# EAGLE schematic SS4 (EAGLE 6.2)
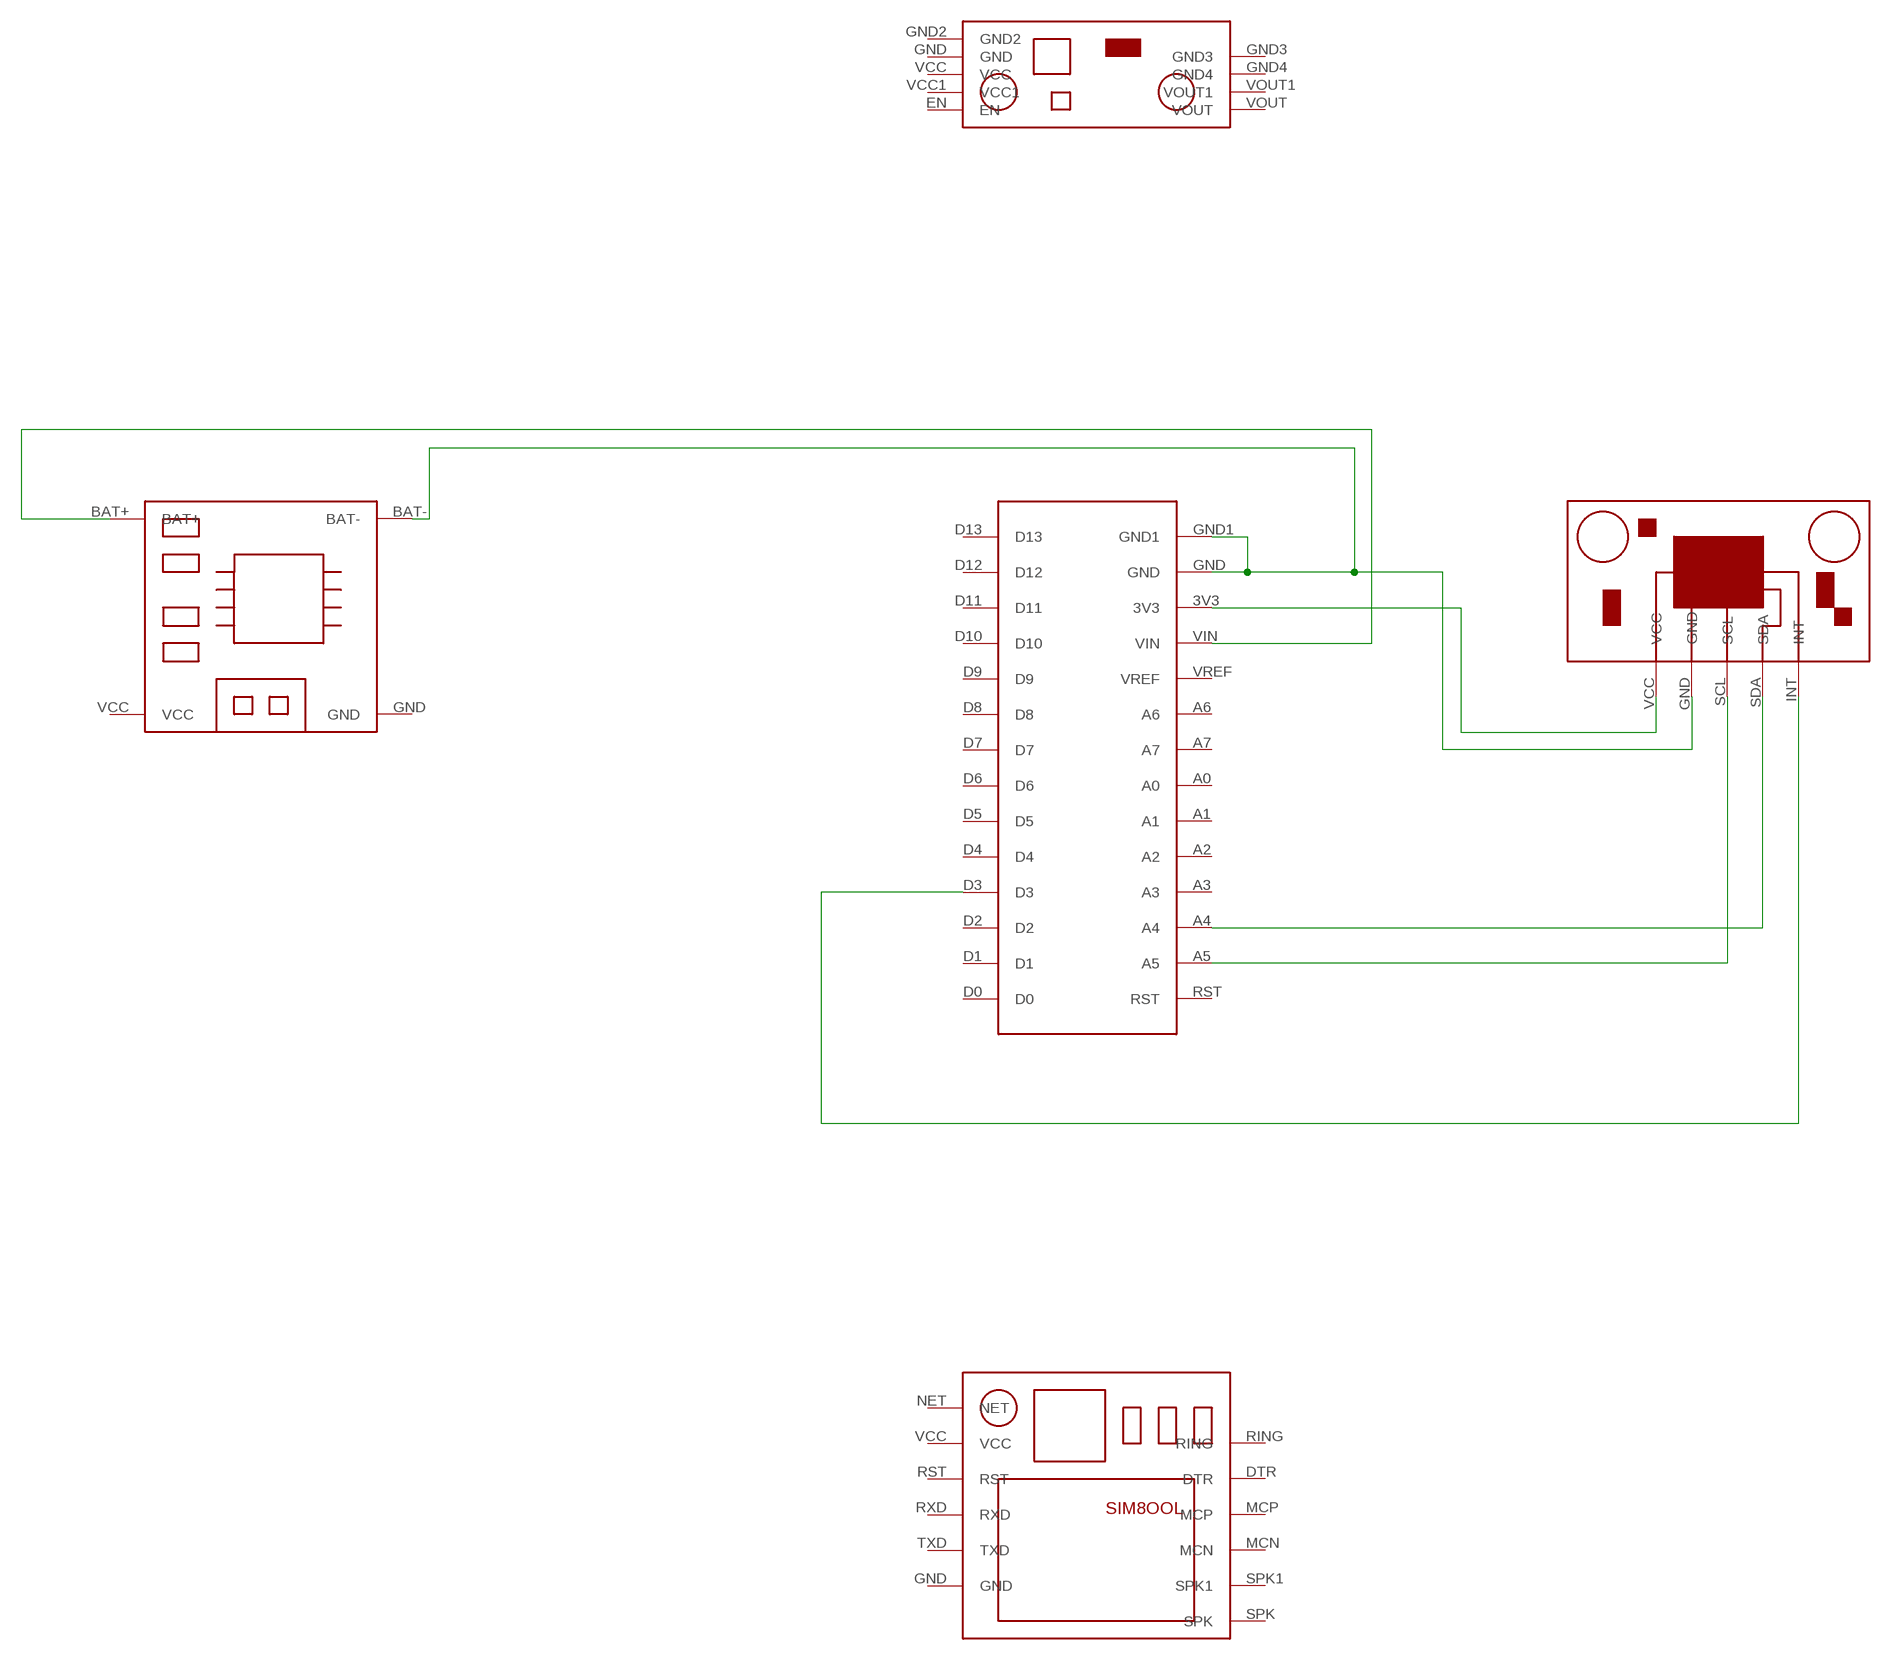
[diagram p0: schematic, sheet 1]

## Parts
U$1  ACELEROMETER  [ACELEROMETER]
U$2  POLOLU_STEP_UP_DOWN  [POLOLU_STEP_UP_DOWN]
U$3  CHARGER  [CHARGER]
U$4  SIM8OOL  [SIM8OOL]
U$5  ULTRA_MINI  [ULTRA_MINI]

## Nets
N$1: U$3.BAT+ U$5.VIN
N$3: U$1.GND U$3.BAT- U$5.GND U$5.GND1
N$4: U$1.VCC U$5.3V3
N$6: U$1.INT U$5.D3
N$7: U$1.SCL U$5.A5
N$8: U$1.SDA U$5.A4
Unconnected: U$2.EN U$2.GND U$2.GND2 U$2.GND3 U$2.GND4 U$2.VCC U$2.VCC1 U$2.VOUT U$2.VOUT1 U$3.GND U$3.VCC U$4.DTR U$4.GND U$4.MCN U$4.MCP U$4.NET U$4.RING U$4.RST U$4.RXD U$4.SPK U$4.SPK1 U$4.TXD U$4.VCC U$5.A0 U$5.A1 U$5.A2 U$5.A3 U$5.A6 U$5.A7 U$5.D0 U$5.D1 U$5.D2 U$5.D4 U$5.D5 U$5.D6 U$5.D7 U$5.D8 U$5.D9 U$5.D10 U$5.D11 U$5.D12 U$5.D13 U$5.RST U$5.VREF

## Library data of the parts
U$1 = ACELEROMETER:ACELEROMETER
U$2 = BOOSTER:POLOLU_STEP_UP_DOWN
U$3 = CHARGER:CHARGER
U$4 = SIM8OOL:SIM8OOL
U$5 = ULTRA_MINI:ULTRA_MINI: ARDUINO_ULTRA_MINI. Rocketscream. By Dennis Revolorio on Flatbox